# Altium schematic sheet UV-Calibrator-Schematic.SchDoc
size A4
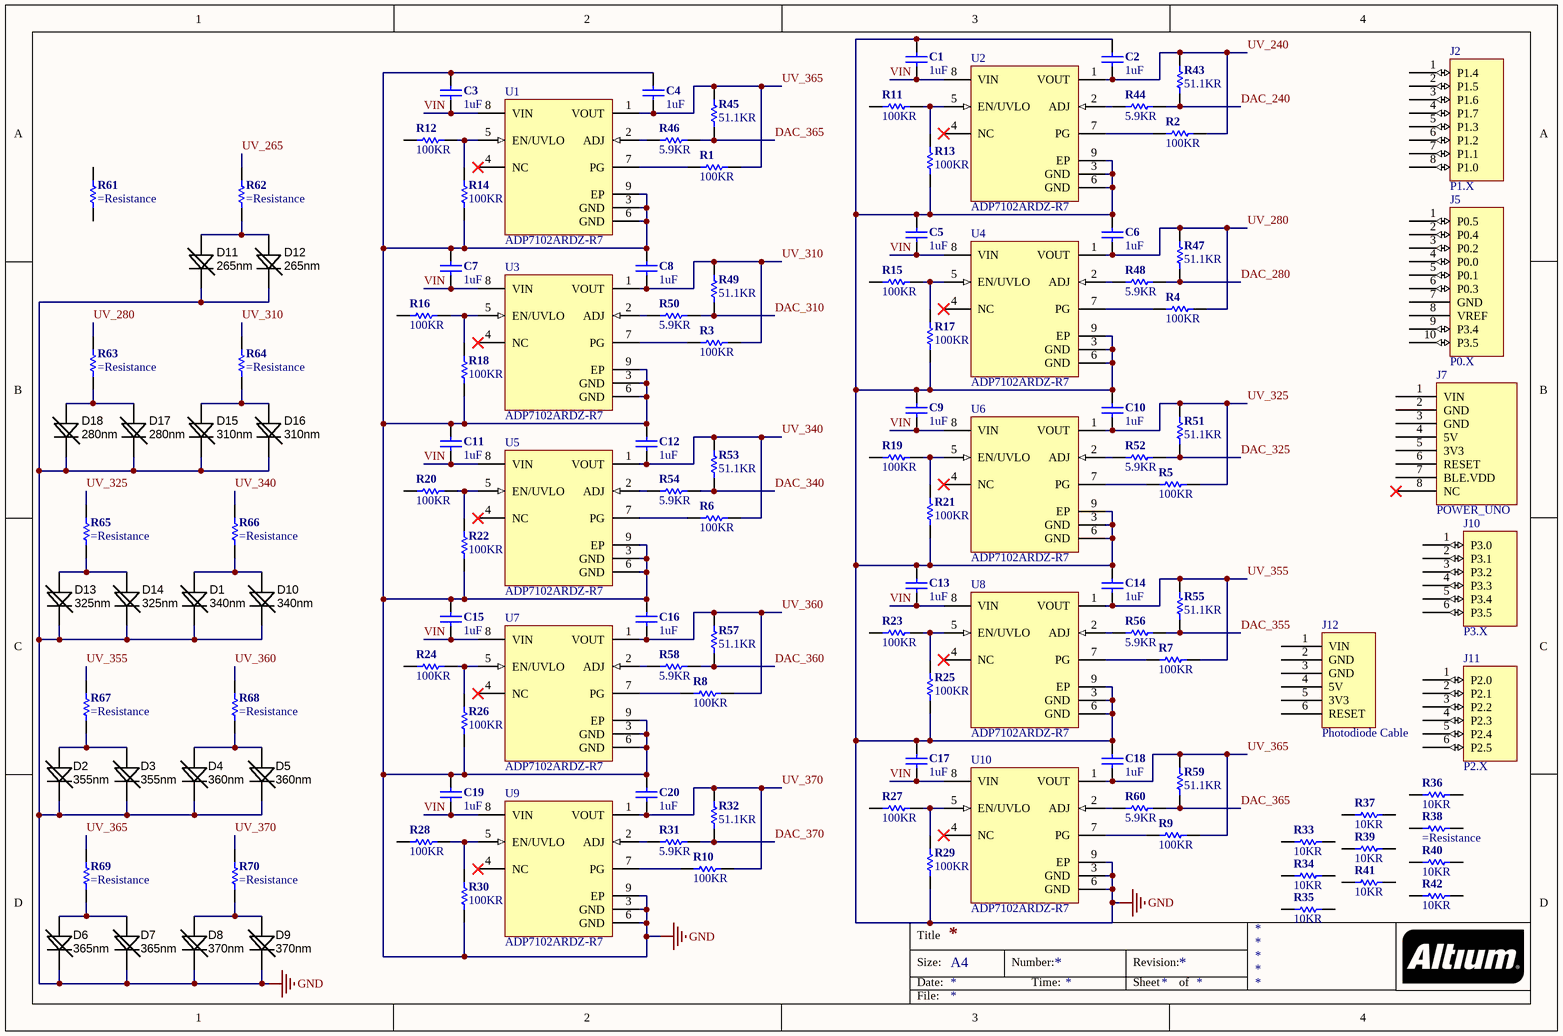
[diagram p0: UV-Calibrator-Schematic.SchDoc]

## Parts
C1  1uF  [CAP-0805(2012)-R]
C2  1uF  [CAP-0805(2012)-R]
C3  1uF  [CAP-0805(2012)-R]
C4  1uF  [CAP-0805(2012)-R]
C5  1uF  [CAP-0805(2012)-R]
C6  1uF  [CAP-0805(2012)-R]
C7  1uF  [CAP-0805(2012)-R]
C8  1uF  [CAP-0805(2012)-R]
C9  1uF  [CAP-0805(2012)-R]
C10  1uF  [CAP-0805(2012)-R]
C11  1uF  [CAP-0805(2012)-R]
C12  1uF  [CAP-0805(2012)-R]
C13  1uF  [CAP-0805(2012)-R]
C14  1uF  [CAP-0805(2012)-R]
C15  1uF  [CAP-0805(2012)-R]
C16  1uF  [CAP-0805(2012)-R]
C17  1uF  [CAP-0805(2012)-R]
C18  1uF  [CAP-0805(2012)-R]
C19  1uF  [CAP-0805(2012)-R]
C20  1uF  [CAP-0805(2012)-R]
D1  340nm  [SMD 3020]
D2  355nm  [3mm LED]
D3  355nm  [3mm LED]
D4  360nm  [3mm LED]
D5  360nm  [3mm LED]
D6  365nm  [3mm LED]
D7  365nm  [3mm LED]
D8  370nm  [3mm LED]
D9  370nm  [3mm LED]
D10  340nm  [SMD 3020]
D11  265nm  [SMD 3020]
D12  265nm  [SMD 3020]
D13  325nm  [SMD 3020]
D14  325nm  [SMD 3020]
D15  310nm  [SMD 3020]
D16  310nm  [SMD 3020]
D17  280nm  [SMD 3020]
D18  280nm  [SMD 3020]
J2  P1.X  [Header 8x1 8.5mm]
J5  P0.X  [Header 10x1 8.5mm]
J7  POWER_UNO  [Header 8x1 8.5mm]
J10  P3.X  [Header 6x1 8.5mm]
J11  P2.X  [Header 6x1 8.5mm]
J12  Photodiode Cable  [Header 6x1 8.5mm]
R1  100KR  [R-0805(2012)-R]
R2  100KR  [R-0805(2012)-R]
R3  100KR  [R-0805(2012)-R]
R4  100KR  [R-0805(2012)-R]
R5  100KR  [R-0805(2012)-R]
R6  100KR  [R-0805(2012)-R]
R7  100KR  [R-0805(2012)-R]
R8  100KR  [R-0805(2012)-R]
R9  100KR  [R-0805(2012)-R]
R10  100KR  [R-0805(2012)-R]
R11  100KR  [R-0805(2012)-R]
R12  100KR  [R-0805(2012)-R]
R13  100KR  [R-0805(2012)-R]
R14  100KR  [R-0805(2012)-R]
R15  100KR  [R-0805(2012)-R]
R16  100KR  [R-0805(2012)-R]
R17  100KR  [R-0805(2012)-R]
R18  100KR  [R-0805(2012)-R]
R19  100KR  [R-0805(2012)-R]
R20  100KR  [R-0805(2012)-R]
R21  100KR  [R-0805(2012)-R]
R22  100KR  [R-0805(2012)-R]
R23  100KR  [R-0805(2012)-R]
R24  100KR  [R-0805(2012)-R]
R25  100KR  [R-0805(2012)-R]
R26  100KR  [R-0805(2012)-R]
R27  100KR  [R-0805(2012)-R]
R28  100KR  [R-0805(2012)-R]
R29  100KR  [R-0805(2012)-R]
R30  100KR  [R-0805(2012)-R]
R31  5.9KR  [R-0805(2012)-R]
R32  51.1KR  [R-0805(2012)-R]
R33  10KR  [R-0805(2012)-R]
R34  10KR  [R-0805(2012)-R]
R35  10KR  [R-0805(2012)-R]
R36  10KR  [R-0805(2012)-R]
R37  10KR  [R-0805(2012)-R]
R38  (no value)  [R-0805(2012)-R]
R39  10KR  [R-0805(2012)-R]
R40  10KR  [R-0805(2012)-R]
R41  10KR  [R-0805(2012)-R]
R42  10KR  [R-0805(2012)-R]
R43  51.1KR  [R-0805(2012)-R]
R44  5.9KR  [R-0805(2012)-R]
R45  51.1KR  [R-0805(2012)-R]
R46  5.9KR  [R-0805(2012)-R]
R47  51.1KR  [R-0805(2012)-R]
R48  5.9KR  [R-0805(2012)-R]
R49  51.1KR  [R-0805(2012)-R]
R50  5.9KR  [R-0805(2012)-R]
R51  51.1KR  [R-0805(2012)-R]
R52  5.9KR  [R-0805(2012)-R]
R53  51.1KR  [R-0805(2012)-R]
R54  5.9KR  [R-0805(2012)-R]
R55  51.1KR  [R-0805(2012)-R]
R56  5.9KR  [R-0805(2012)-R]
R57  51.1KR  [R-0805(2012)-R]
R58  5.9KR  [R-0805(2012)-R]
R59  51.1KR  [R-0805(2012)-R]
R60  5.9KR  [R-0805(2012)-R]
R61  (no value)  [R-0805(2012)-R]
R62  (no value)  [R-0805(2012)-R]
R63  (no value)  [R-0805(2012)-R]
R64  (no value)  [R-0805(2012)-R]
R65  (no value)  [R-0805(2012)-R]
R66  (no value)  [R-0805(2012)-R]
R67  (no value)  [R-0805(2012)-R]
R68  (no value)  [R-0805(2012)-R]
R69  (no value)  [R-0805(2012)-R]
R70  (no value)  [R-0805(2012)-R]
U1  ADP7102ARDZ-R7  [ADI-RD-8-2_N]
U2  ADP7102ARDZ-R7  [ADI-RD-8-2_N]
U3  ADP7102ARDZ-R7  [ADI-RD-8-2_N]
U4  ADP7102ARDZ-R7  [ADI-RD-8-2_N]
U5  ADP7102ARDZ-R7  [ADI-RD-8-2_N]
U6  ADP7102ARDZ-R7  [ADI-RD-8-2_N]
U7  ADP7102ARDZ-R7  [ADI-RD-8-2_N]
U8  ADP7102ARDZ-R7  [ADI-RD-8-2_N]
U9  ADP7102ARDZ-R7  [ADI-RD-8-2_N]
U10  ADP7102ARDZ-R7  [ADI-RD-8-2_N]

## Nets
GND: C1.1 C2.1 C3.1 C4.1 C5.1 C6.1 C7.1 C8.1 C9.1 C10.1 C11.1 C12.1 C13.1 C14.1 C15.1 C16.1 C17.1 C18.1 C19.1 C20.1 D1.K D2.K D3.K D4.K D5.K D6.K D7.K D8.K D9.K D10.K D11.K D12.K D13.K D14.K D15.K D16.K D17.K D18.K R13.1 R14.1 R17.1 R18.1 R21.1 R22.1 R25.1 R26.1 R29.1 R30.1 U1.3(GND) U1.6(GND) U1.9(EP) U2.3(GND) U2.6(GND) U2.9(EP) U3.3(GND) U3.6(GND) U3.9(EP) U4.3(GND) U4.6(GND) U4.9(EP) U5.3(GND) U5.6(GND) U5.9(EP) U6.3(GND) U6.6(GND) U6.9(EP) U7.3(GND) U7.6(GND) U7.9(EP) U8.3(GND) U8.6(GND) U8.9(EP) U9.3(GND) U9.6(GND) U9.9(EP) U10.3(GND) U10.6(GND) U10.9(EP)
DAC_240: R43.2 R44.2
DAC_280: R47.2 R48.2
DAC_310: R49.2 R50.2
DAC_325: R51.2 R52.2
DAC_340: R53.2 R54.2
DAC_355: R55.2 R56.2
DAC_360: R57.2 R58.2
DAC_365: R45.2 R46.2 R59.2 R60.2
DAC_370: R31.2 R32.2
UV_240: C2.2 R2.2 R43.1 U2.1(VOUT)
UV_265: R62.1
UV_280: C6.2 R4.2 R47.1 R63.1 U4.1(VOUT)
UV_310: C8.2 R3.2 R49.1 R64.1 U3.1(VOUT)
UV_325: C10.2 R5.2 R51.1 R65.1 U6.1(VOUT)
UV_340: C12.2 R6.2 R53.1 R66.1 U5.1(VOUT)
UV_355: C14.2 R7.2 R55.1 R67.1 U8.1(VOUT)
UV_360: C16.2 R8.2 R57.1 R68.1 U7.1(VOUT)
UV_365: C4.2 C18.2 R1.2 R9.2 R45.1 R59.1 R69.1 U1.1(VOUT) U10.1(VOUT)
UV_370: C20.2 R10.2 R32.1 R70.1 U9.1(VOUT)
VIN: C1.2 C3.2 C5.2 C7.2 C9.2 C11.2 C13.2 C15.2 C17.2 C19.2 U1.8(VIN) U2.8(VIN) U3.8(VIN) U4.8(VIN) U5.8(VIN) U6.8(VIN) U7.8(VIN) U8.8(VIN) U9.8(VIN) U10.8(VIN)
NetD1_A: D1.A D10.A R66.2
NetD2_A: D2.A D3.A R67.2
NetD4_A: D4.A D5.A R68.2
NetD6_A: D6.A D7.A R69.2
NetD8_A: D8.A D9.A R70.2
NetD11_A: D11.A D12.A R62.2
NetD13_A: D13.A D14.A R65.2
NetD15_A: D15.A D16.A R64.2
NetD17_A: D17.A D18.A R63.2
NetR1_1: R1.1 U1.7(PG)
NetR2_1: R2.1 U2.7(PG)
NetR3_1: R3.1 U3.7(PG)
NetR4_1: R4.1 U4.7(PG)
NetR5_1: R5.1 U6.7(PG)
NetR6_1: R6.1 U5.7(PG)
NetR7_1: R7.1 U8.7(PG)
NetR8_1: R8.1 U7.7(PG)
NetR9_1: R9.1 U10.7(PG)
NetR10_1: R10.1 U9.7(PG)
NetR11_2: R11.2 R13.2 U2.5(EN/UVLO)
NetR12_2: R12.2 R14.2 U1.5(EN/UVLO)
NetR15_2: R15.2 R17.2 U4.5(EN/UVLO)
NetR16_2: R16.2 R18.2 U3.5(EN/UVLO)
NetR19_2: R19.2 R21.2 U6.5(EN/UVLO)
NetR20_2: R20.2 R22.2 U5.5(EN/UVLO)
NetR23_2: R23.2 R25.2 U8.5(EN/UVLO)
NetR24_2: R24.2 R26.2 U7.5(EN/UVLO)
NetR27_2: R27.2 R29.2 U10.5(EN/UVLO)
NetR28_2: R28.2 R30.2 U9.5(EN/UVLO)
NetR31_1: R31.1 U9.2(ADJ)
NetR44_1: R44.1 U2.2(ADJ)
NetR46_1: R46.1 U1.2(ADJ)
NetR48_1: R48.1 U4.2(ADJ)
NetR50_1: R50.1 U3.2(ADJ)
NetR52_1: R52.1 U6.2(ADJ)
NetR54_1: R54.1 U5.2(ADJ)
NetR56_1: R56.1 U8.2(ADJ)
NetR58_1: R58.1 U7.2(ADJ)
NetR60_1: R60.1 U10.2(ADJ)

Not connected (* = marked no-connect by the designer): J2 1(P1.4) 2(P1.5) 3(P1.6) 4(P1.7) 5(P1.3) 6(P1.2) 7(P1.1) 8(P1.0); J5 1(P0.5) 2(P0.4) 3(P0.2) 4(P0.0) 5(P0.1) 6(P0.3) 7(GND) 8(VREF) 9(P3.4) 10(P3.5); J7 1(VIN) 2(GND) 3(GND) 4(5V) 5(3V3) 6(RESET) 7(BLE.VDD) 8(NC)*; J10 1(P3.0) 2(P3.1) 3(P3.2) 4(P3.3) 5(P3.4) 6(P3.5); J11 1(P2.0) 2(P2.1) 3(P2.2) 4(P2.3) 5(P2.4) 6(P2.5); J12 1(VIN) 2(GND) 3(GND) 4(5V) 5(3V3) 6(RESET); R11 1; R12 1; R15 1; R16 1; R19 1; R20 1; R23 1; R24 1; R27 1; R28 1; R33 1 2; R34 1 2; R35 1 2; R36 1 2; R37 1 2; R38 1 2; R39 1 2; R40 1 2; R41 1 2; R42 1 2; R61 1 2; U1 4(NC)*; U2 4(NC)*; U3 4(NC)*; U4 4(NC)*; U5 4(NC)*; U6 4(NC)*; U7 4(NC)*; U8 4(NC)*; U9 4(NC)*; U10 4(NC)*

## Notes on the sheet
- Title
- Size:
- Date:
- A4
- Number:
- Time:
- Revision:
- Sheet
- of
- File:

## Library data of the parts
C1-C20 = C-0805(2012): ___ OHM ___ mW 0805(2012) SMD; Manufacturer: Yageo; Manufacturer Part Number: CC0805KKX7R7BB105; Description 1: CAP CER 1UF 16V X7R 0805; Tolerance: 10%; Voltage Rating: 16V; Dielectric: X7R; Supplier 1: Digi-Key; Supplier Part Number 1: 311-1365-1-ND; Stock 1: 1167243; Pricing 1: 1=0.11, 10=0.079, 100=0.0352, 500=0.0252, 1000=0.0198 (USD); Mount: Surface Mount; Case/Package: 0805; Case Code (Metric): 2012; Case Code (Imperial): 0805; Min Operating Temperature: -55°C; Max Operating Temperature: 125°C; Packaging: Tape and Reel; Capacitance: 1uF; Package Quantity: 1; Termination: SMD/SMT; Voltage Rating (DC): 16V; Length: 2mm; Width: 0.049inch; Thickness: 0.049inch; Depth: 1.25mm; Radiation Hardening: No; REACH SVHC: No SVHC; Lead Free: Lead Free; Halogen Free: Halogen Free; ComponentLink1URL: https://datasheet.ciiva.com/144/mlccorderingcode-144902.pdf; ComponentLink1Description: https://datasheet.ciiva.com/144/mlccorderingcode-144902.pdf; ComponentLink2URL: https://datasheet.ciiva.com/13173/upy-gp-np0-16v-to-50v-8-3714-13173254.pdf; ComponentLink2Description: https://datasheet.ciiva.com/13173/upy-gp-np0-16v-to-50v-8-3714-13173254.pdf; ComponentLink3URL: https://datasheet.ciiva.com/15189/getdatasheetpartid-251802-15189206.pdf; ComponentLink3Description: https://datasheet.ciiva.com/15189/getdatasheetpartid-251802-15189206.pdf; ComponentLink4URL: https://datasheet.ciiva.com/144/mlccorderingcode-144903.pdf; ComponentLink4Description: https://datasheet.ciiva.com/144/mlccorderingcode-144903.pdf; ComponentLink5URL: https://datasheet.ciiva.com/144/mlccorderingcode-144904.pdf; ComponentLink5Description: https://datasheet.ciiva.com/144/mlccorderingcode-144904.pdf; ComponentLink6URL: https://datasheet.ciiva.com/7978/1489800-7978201.pdf; ComponentLink6Description: https://datasheet.ciiva.com/7978/1489800-7978201.pdf; ComponentLink7URL: https://datasheet.ciiva.com/11464/upy-gphc-x7r-6-3v-to-50v-8-11464750.pdf; ComponentLink7Description: https://datasheet.ciiva.com/11464/upy-gphc-x7r-6-3v-to-50v-8-11464750.pdf; ComponentLink8URL: https://datasheet.ciiva.com/28450/1489800-28450750.pdf; ComponentLink8Description: https://datasheet.ciiva.com/28450/1489800-28450750.pdf
D1 D10-D18 = DUVxxx-SMD: SMD 3020 UV Wavelength; Wavelength: 265/280/310/325/340; Category: Optoelectronics; Color: UV
D2-D9 = XSL-365-LED: LED, Through Hole 3mm; Color: UV; Wavelength: 355/360/365/370; Category: Optoelectronics
J2 = IOL
J5 = IOH
J10 = AD
J12 = PD_Calibration
R1-R30 = R-0805(2012): ___ OHM ___ mW 0805(2012) SMD; Manufacturer: Yageo; Manufacturer Part Number: RC0805FR-07100KL; Description 1: RES SMD 100K OHM 1% 1/8W 0805; Tolerance: 1%; Temperature Coefficient: 100ppm/°C; Voltage Rating (DC): 150V; Power Rating: 125mW; Supplier 1: Digi-Key; Supplier Part Number 1: 311-100KCRCT-ND; Stock 1: 3638927; Pricing 1: 1=0.1, 10=0.022, 100=0.0088, 1000=0.004, 2500=0.0034 (USD); Case/Package: 0805; Number of Pins: 2; Case Code (Metric): 2012; Case Code (Imperial): 0805; Min Operating Temperature: -55°C; Max Operating Temperature: 155°C; Resistance: 100KR; Packaging: Tape and Reel; Composition: Thick Film; Voltage Rating: 150V; Package Quantity: 1; Number of Terminations: 2; Termination: SMD/SMT; Military Standard: Not; Max Power Dissipation: 125mW; Length: 2mm; Height: 0.024inch; Width: 0.049inch; Depth: 1.25mm; Lead Pitch: 0.4mm; REACH SVHC: Unknown; Lead Free: Lead Free; ComponentLink1URL: https://datasheet.ciiva.com/2457/pyu-r-int-thick-7-2457017.pdf; ComponentLink1Description: https://datasheet.ciiva.com/2457/pyu-r-int-thick-7-2457017.pdf; ComponentLink2URL: https://datasheet.ciiva.com/12667/rc0805-12667001.pdf; ComponentLink2Description: https://datasheet.ciiva.com/12667/rc0805-12667001.pdf; ComponentLink3URL: https://datasheet.ciiva.com/2457/pyu-r-int-thick-7-2457018.pdf; ComponentLink3Description: https://datasheet.ciiva.com/2457/pyu-r-int-thick-7-2457018.pdf; ComponentLink4URL: https://datasheet.ciiva.com/11808/0900766b8106beab-11808858.pdf; ComponentLink4Description: https://datasheet.ciiva.com/11808/0900766b8106beab-11808858.pdf; ComponentLink5URL: https://datasheet.ciiva.com/16747/rc0805-16747226.pdf; ComponentLink5Description: https://datasheet.ciiva.com/16747/rc0805-16747226.pdf; ComponentLink6URL: https://datasheet.ciiva.com/2457/pyu-r-int-thick-7-2457019.pdf; ComponentLink6Description: https://datasheet.ciiva.com/2457/pyu-r-int-thick-7-2457019.pdf; ComponentLink7URL: https://datasheet.ciiva.com/7660/38627-7660796.pdf; ComponentLink7Description: https://datasheet.ciiva.com/7660/38627-7660796.pdf; ComponentLink8URL: https://datasheet.ciiva.com/7941/1697719-7941676.pdf; ComponentLink8Description: https://datasheet.ciiva.com/7941/1697719-7941676.pdf; ComponentLink9URL: https://datasheet.ciiva.com/7941/1686128-7941677.pdf; ComponentLink9Description: https://datasheet.ciiva.com/7941/1686128-7941677.pdf; ComponentLink10URL: https://datasheet.ciiva.com/7941/1697719-7941678.pdf; ComponentLink10Description: https://datasheet.ciiva.com/7941/1697719-7941678.pdf; ComponentLink11URL: https://datasheet.ciiva.com/22747/444164-22747534.pdf; ComponentLink11Description: https://datasheet.ciiva.com/22747/444164-22747534.pdf
R31 R44 R46 R48 R50 R52 R54 R56 R58 R60 = R-0805(2012): ___ OHM ___ mW 0805(2012) SMD; Manufacturer: Yageo; Manufacturer Part Number: RC0805FR-075K9L; Description 1: Thick Film Resistors - SMD 5.9K OHM 1%; Power Rating: 125mW; Tolerance: 1%; Voltage Rating: 150V; Temperature Coefficient: 100ppm/°C; Supplier 1: Digi-Key; Supplier Part Number 1: 311-5.90KCRDKR-ND; Stock 1: 106699; Pricing 1: 1=0.1, 10=0.022, 100=0.0088, 1000=0.004, 2500=0.0034 (USD); Case/Package: 0805; Case Code (Imperial): 0805; Case Code (Metric): 2012; Min Operating Temperature: -55°C; Max Operating Temperature: 155°C; Packaging: Tape and Reel; Package Quantity: 5000; Resistance: 5.9KR; Termination: SMD/SMT; Composition: Thick Film; Military Standard: Not; Voltage Rating (DC): 150V; Length: 2mm; Height: 0.5mm; Width: 1.25mm; Depth: 1.25mm; Lead Free: Lead Free; ComponentLink1URL: https://datasheet.ciiva.com/17483/rc0805-17483998.pdf; ComponentLink1Description: https://datasheet.ciiva.com/17483/rc0805-17483998.pdf
R32 R43 R45 R47 R49 R51 R53 R55 R57 R59 = R-0805(2012): ___ OHM ___ mW 0805(2012) SMD; Manufacturer: Yageo; Manufacturer Part Number: RC0805FR-0751K1L; Description 1: Thick Film Resistors - SMD 51.1K OHM 1%; Tolerance: 1%; Power Rating: 125mW; Voltage Rating: 150V; Temperature Coefficient: 100ppm/°C; Supplier 1: Mouser; Supplier Part Number 1: 603-RC0805FR-0751K1L; Stock 1: 63700; Pricing 1: 1=0.1, 10=0.016, 100=0.006, 1000=0.004, 5000=0.003, 25000=0.002 (USD); Case/Package: 0805; Case Code (Imperial): 0805; Case Code (Metric): 2012; Min Operating Temperature: -55°C; Max Operating Temperature: 155°C; Resistance: 51.1KR; Packaging: Tape and Reel; Termination: SMD/SMT; Composition: Thick Film; Military Standard: Not; Voltage Rating (DC): 150V; Length: 2mm; Depth: 1.25mm; Lead Free: Lead Free; ComponentLink1URL: https://datasheet.ciiva.com/15189/getdatasheetpartid-326677-15189989.pdf; ComponentLink1Description: https://datasheet.ciiva.com/15189/getdatasheetpartid-326677-15189989.pdf; ComponentLink2URL: https://datasheet.ciiva.com/17040/rc0805-17040663.pdf; ComponentLink2Description: https://datasheet.ciiva.com/17040/rc0805-17040663.pdf; ComponentLink3URL: https://datasheet.ciiva.com/12668/rc0805-12668248.pdf; ComponentLink3Description: https://datasheet.ciiva.com/12668/rc0805-12668248.pdf
R33-R37 R39-R42 = R-0805(2012): ___ OHM ___ mW 0805(2012) SMD; Manufacturer: Yageo; Manufacturer Part Number: RC0805FR-0710KL; Description 1: RES SMD 10K OHM 1% 1/8W 0805; Tolerance: 1%; Temperature Coefficient: 100ppm/°C; Power Rating: 125mW; Voltage Rating: 150V; Supplier 1: Digi-Key; Supplier Part Number 1: 311-10.0KCRCT-ND; Stock 1: 9732587; Pricing 1: 1=0.1, 10=0.022, 100=0.0088, 1000=0.004, 2500=0.0034 (USD); Case/Package: 0805; Case Code (Imperial): 0805; Case Code (Metric): 2012; Min Operating Temperature: -55°C; Max Operating Temperature: 155°C; Packaging: Tape and Reel; Resistance: 10KR; Composition: Thick Film; Package Quantity: 1; Termination: SMD/SMT; Number of Terminations: 2; Military Standard: Not; Max Power Dissipation: 125mW; Length: 2mm; Height: 0.024inch; Width: 0.049inch; Depth: 1.25mm; REACH SVHC: Unknown; Lead Free: Lead Free; ComponentLink1URL: https://datasheet.ciiva.com/11808/0900766b8106beab-11808151.pdf; ComponentLink1Description: https://datasheet.ciiva.com/11808/0900766b8106beab-11808151.pdf; ComponentLink2URL: https://datasheet.ciiva.com/12669/rc0805-12669688.pdf; ComponentLink2Description: https://datasheet.ciiva.com/12669/rc0805-12669688.pdf; ComponentLink3URL: https://datasheet.ciiva.com/46447/444164-46447563.pdf; ComponentLink3Description: https://datasheet.ciiva.com/46447/444164-46447563.pdf; ComponentLink4URL: https://datasheet.ciiva.com/2456/pyu-r-int-thick-7-2456972.pdf; ComponentLink4Description: https://datasheet.ciiva.com/2456/pyu-r-int-thick-7-2456972.pdf; ComponentLink5URL: https://datasheet.ciiva.com/2456/pyu-r-int-thick-7-2456973.pdf; ComponentLink5Description: https://datasheet.ciiva.com/2456/pyu-r-int-thick-7-2456973.pdf; ComponentLink6URL: https://datasheet.ciiva.com/2456/pyu-r-int-thick-7-2456974.pdf; ComponentLink6Description: https://datasheet.ciiva.com/2456/pyu-r-int-thick-7-2456974.pdf; ComponentLink7URL: https://datasheet.ciiva.com/16747/rc0805-16747087.pdf; ComponentLink7Description: https://datasheet.ciiva.com/16747/rc0805-16747087.pdf
R38 R61-R70 = R-0805(2012): ___ OHM ___ mW 0805(2012) SMD
U1-U10 = CMP-0786-00204-1: 300 mA, Low Noise, CMOS LDO, 3.3 to 20 V Vin, 1.22 to Vin-Vdo Vout, Industrial, 8-pin SOIC (RD-8-2), Reel; Manufacturer: Analog Devices; Iout max: 300mA; Vout Adjustable Range: 1.22V to 19V; Vin (min) (V): 3.3; Supply Current IGND @ Small Load: 400uA; Vin (max) (V): 20; Packing: Reel; ComponentLink2URL: http://www.analog.com/static/imported-files/data_sheets/ADP7102.pdf; ComponentLink1Description: Manufacturer URL; ComponentLink4Description: URL Link1; PackageDescription: 8-Pin Standard Small Outline Package, Body 4.9 x 3.9 mm, Pitch 1.27 mm; PackageVersion: Jan-05; ComponentLink1URL: http://www.analog.com/en/index.html; Code_JEDEC: MS-012-AA; ComponentLink2Description: Datasheet; PartNumber: ADP7102ARDZ-R7; Mounting Technology: Surface Mount; PackageReference: RD-8-2; ComponentLink3Description: Package Specification; ComponentLink3URL: http://www.analog.com/static/imported-files/packages/62062404671038RD_8_2.pdf; DatasheetVersion: Rev. A; ComponentLink4URL: Product URL:http://www.analog.com/en/ADP7102/productSearch.html